# EAGLE schematic max7219_high_voltage (EAGLE 9.0.1)
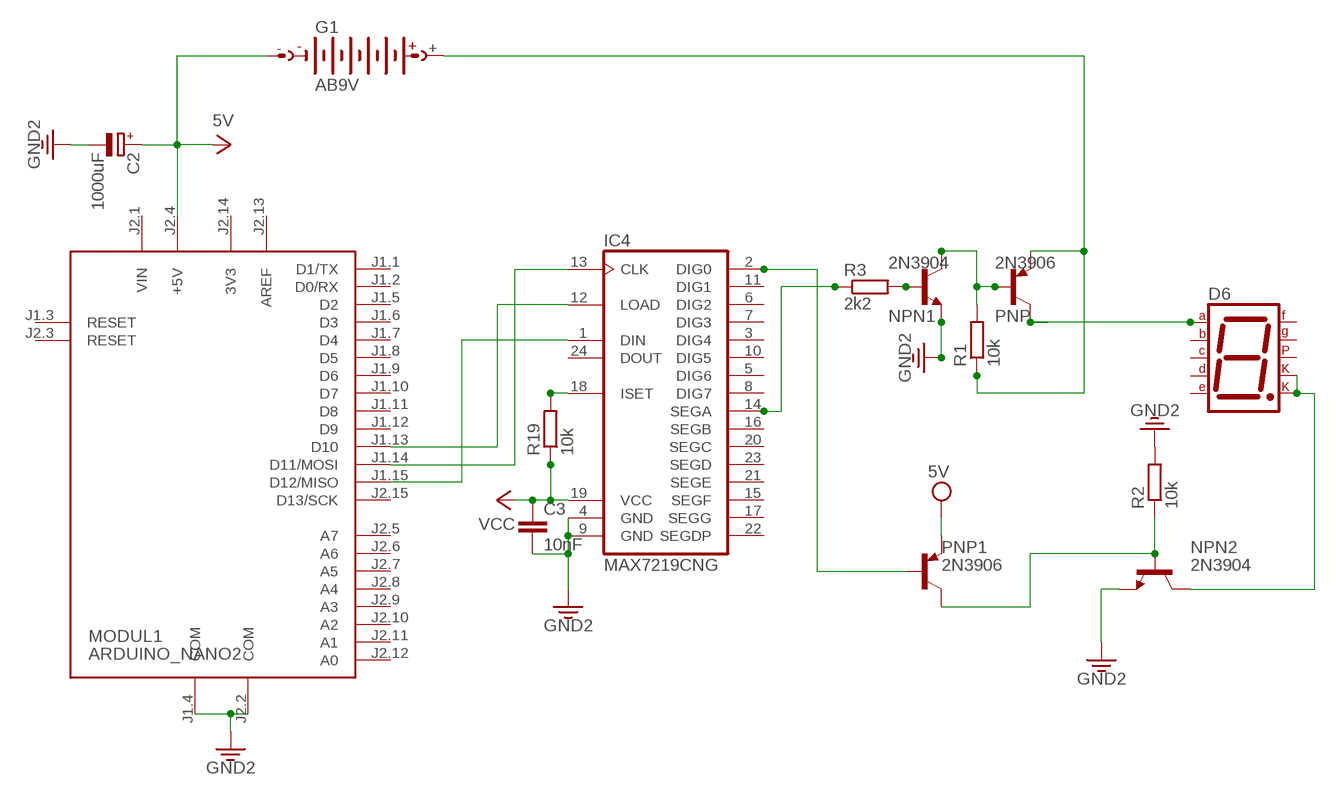
[diagram p0: schematic, sheet 1]

## Parts
C2  1000uF  CPOL-EUE5-10.5  [E5-10,5]
C3  10nF  C-EU025-025X050  [C025-025X050]
D6  7SEG-MCK  [7SEG-7]
G1  AB9V  [AB9V]
IC4  MAX7219CNG  [DIL24-3]
MODUL1  ARDUINO_NANO2  [ARDUINO_NANO2]
NPN1  2N3904  [TO92]
NPN2  2N3904  [TO92]
PNP  2N3906  [TO92]
PNP1  2N3906  [TO92]
R1  10k  R-EU_0204/7  [0204/7]
R2  10k  R-EU_0204/7  [0204/7]
R3  2k2  R-EU_0204/7  [0204/7]
R19  10k  R-EU_0204/7  [0204/7]

## Nets
3.3V: C2.- C3.2 IC4.4(GND) IC4.9(GND) MODUL1.J1.4(COM) MODUL1.J2.2(COM) NPN1.3(E) NPN2.3(E) R2.2 ; supply symbol labelled GND2
N$1: D6.1(CK1) D6.6(CK2) NPN2.1(C)
N$2: IC4.2(DIG0) PNP1.2(B)
N$3: NPN1.2(B) R3.2
N$4: NPN1.1(C) PNP.2(B) R1.2
N$5: G1.+ PNP.3(E) R1.1
N$6: NPN2.2(B) PNP1.1(C) R2.1
N$22: D6.10(A) PNP.1(C)
N$41: IC4.14(SEGA) R3.1
N$50: IC4.18(ISET) R19.2
N$101: IC4.13(CLK) MODUL1.J1.14(D11/MOSI)
N$102: IC4.12(LOAD) MODUL1.J1.13(D10)
N$103: IC4.1(DIN) MODUL1.J1.15(D12/MISO)
VCC: C2.+ C3.1 G1.- IC4.19(VCC) MODUL1.J2.4(+5V) PNP1.3(E) R19.1 ; supply symbol labelled 5V
Unconnected: D6.2(F) D6.3(G) D6.4(E) D6.5(D) D6.7(DP) D6.8(C) D6.9(B) IC4.3(DIG4) IC4.5(DIG6) IC4.6(DIG2) IC4.7(DIG3) IC4.8(DIG7) IC4.10(DIG5) IC4.11(DIG1) IC4.15(SEGF) IC4.16(SEGB) IC4.17(SEGG) IC4.20(SEGC) IC4.21(SEGE) IC4.22(SEGDP) IC4.23(SEGD) IC4.24(DOUT) MODUL1.J1.1(D1/TX) MODUL1.J1.2(D0/RX) MODUL1.J1.3(RESET) MODUL1.J1.5(D2) MODUL1.J1.6(D3) MODUL1.J1.7(D4) MODUL1.J1.8(D5) MODUL1.J1.9(D6) MODUL1.J1.10(D7) MODUL1.J1.11(D8) MODUL1.J1.12(D9) MODUL1.J2.3(RESET) MODUL1.J2.5(A7) MODUL1.J2.6(A6) MODUL1.J2.7(A5) MODUL1.J2.8(A4) MODUL1.J2.9(A3) MODUL1.J2.10(A2) MODUL1.J2.11(A1) MODUL1.J2.12(A0) MODUL1.J2.15(D13/SCK)

## Power pins joined to a net without a drawn wire
3V3: MODUL1.J2.14(3V3)
AREF: MODUL1.J2.13(AREF)
VIN: MODUL1.J2.1(VIN)

## Library data of the parts
C2 = resistor:CPOL-EU: POLARIZED CAPACITOR, European symbol
C3 = resistor:C-EU: CAPACITOR, European symbol
D6 = special:7SEG-MCK: 7-segment DISPLAY single cathode, 13 mm
G1 = battery:AB9V: 9-V BATTERY CLIP
IC4 = maxim:MAX7219CNG: LED DISPLAY DRIVER; MF: MAXIM; MPN: MAX7219CNG; OC_FARNELL: 1523914; OC_NEWARK: 34C4018
MODUL1 = arduino:ARDUINO_NANO2: Arduino Nano2 Auto generated by modulcreator.ulp \;; ANZAHL: 2; MODUL: TRUE; STECKX0: -76200; STECKX1: 76200; STECKY0: 177800; STECKY1: 177800
NPN1 NPN2 = transistor-npn:2N3904: NPN Transistor
PNP PNP1 = transistor-pnp:2N3906: PNP Transistor
R1-R3 R19 = resistor:R-EU_: RESISTOR, European symbol